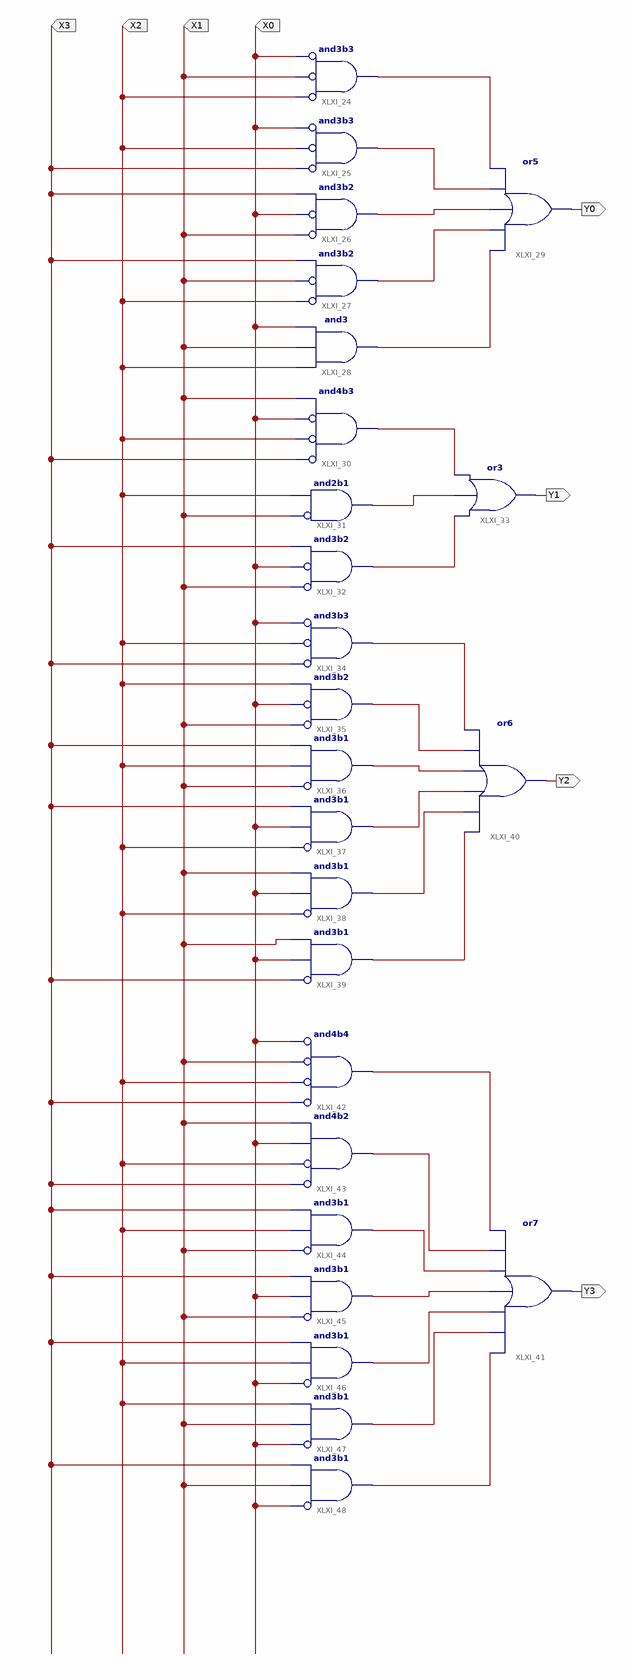
[diagram p0: schematic sheet 1]
// Xilinx ISE schematic DNF.sch (artix7) as structural Verilog: 25 symbols, 8 ports
module DNF (
  input  X3,
  input  X2,
  input  X0,
  input  X1,
  output Y0,
  output Y2,
  output Y3,
  output Y1
);

  wire XLXN_32, XLXN_33, XLXN_34, XLXN_35, XLXN_36, XLXN_38, XLXN_39, XLXN_40, XLXN_41, XLXN_42, XLXN_43,
       XLXN_44, XLXN_45, XLXN_46, XLXN_48, XLXN_49, XLXN_50, XLXN_51, XLXN_52, XLXN_53, XLXN_54;

  and XLXI_24 (XLXN_32, ~X2, ~X1, ~X0);  // and3b3
  and XLXI_25 (XLXN_33, ~X3, ~X2, ~X0);  // and3b3
  and XLXI_26 (XLXN_34, ~X1, ~X0, X3);  // and3b2
  and XLXI_27 (XLXN_35, ~X2, ~X1, X3);  // and3b2
  and XLXI_28 (XLXN_36, X2, X1, X0);
  or XLXI_29 (Y0, XLXN_36, XLXN_35, XLXN_34, XLXN_33, XLXN_32);
  and XLXI_30 (XLXN_38, ~X3, ~X2, ~X0, X1);  // and4b3
  and XLXI_31 (XLXN_39, ~X1, X2);  // and2b1
  and XLXI_32 (XLXN_40, ~X1, ~X0, X3);  // and3b2
  or XLXI_33 (Y1, XLXN_40, XLXN_39, XLXN_38);
  and XLXI_34 (XLXN_41, ~X3, ~X2, ~X0);  // and3b3
  and XLXI_35 (XLXN_42, ~X1, ~X0, X2);  // and3b2
  and XLXI_36 (XLXN_43, ~X1, X2, X3);  // and3b1
  and XLXI_37 (XLXN_44, ~X2, X0, X3);  // and3b1
  and XLXI_38 (XLXN_45, ~X2, X0, X1);  // and3b1
  and XLXI_39 (XLXN_46, ~X3, X0, X1);  // and3b1
  or XLXI_40 (Y2, XLXN_46, XLXN_45, XLXN_44, XLXN_43, XLXN_42, XLXN_41);
  or XLXI_41 (Y3, XLXN_54, XLXN_53, XLXN_52, XLXN_51, XLXN_50, XLXN_49, XLXN_48);
  and XLXI_42 (XLXN_48, ~X3, ~X2, ~X1, ~X0);  // and4b4
  and XLXI_43 (XLXN_49, ~X3, ~X2, X0, X1);  // and4b2
  and XLXI_44 (XLXN_50, ~X1, X2, X3);  // and3b1
  and XLXI_45 (XLXN_51, ~X1, X0, X3);  // and3b1
  and XLXI_46 (XLXN_52, ~X0, X2, X3);  // and3b1
  and XLXI_47 (XLXN_53, ~X0, X1, X2);  // and3b1
  and XLXI_48 (XLXN_54, ~X0, X1, X3);  // and3b1
endmodule
